# EAGLE design Blink_Schematic (EAGLE 9.1.0)
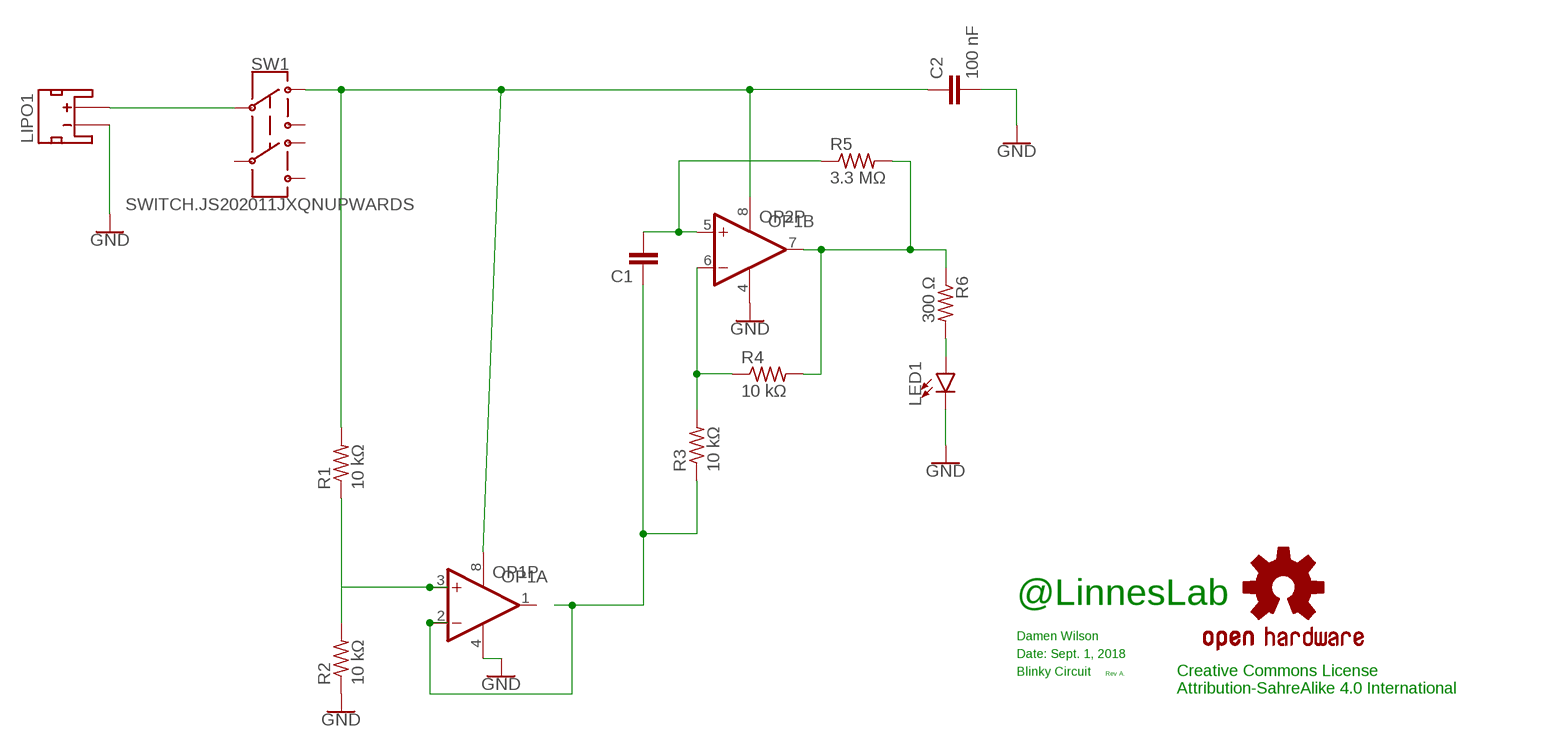
[diagram p0: schematic, sheet 1]

## Parts
C1  C-EUC0402  [C0402]
C2  100 nF  C-EUC0402  [C0402]
LED1  LED0603  [LED-0603]
LIPO1  JST_2MM_MALE  [JST-2-SMD]
LOGO1  OSHW-LOGOS-COPPER  [OSHW-LOGO-S_COPPER]
OP1  OP-DUALRM  [MSOP08]
OP2  OP-DUALRM  [MSOP08]
R1  10 kΩ  R-US_R0402  [R0402]
R2  10 kΩ  R-US_R0402  [R0402]
R3  10 kΩ  R-US_R0402  [R0402]
R4  10 kΩ  R-US_R0402  [R0402]
R5  3.3 MΩ  R-US_R0402  [R0402]
R6  300 Ω  R-US_R0402  [R0402]
SW1  SWITCH.JS202011JXQNUPWARDS  [SWITCH.00]

## Nets
GND: C2.2 LED1.C LIPO1.1(-) OP1.4(P:V-) OP2.4(P:V-) R2.1
N$1: LED1.A R6.2
N$2: OP1.7(B:OUT) R4.2 R5.2 R6.1
N$3: C2.1 OP1.8(P:V+) OP2.8(P:V+) R1.2 SW1.1
N$4: C1.2 OP1.5(B:+IN) R5.1
N$5: C1.1 OP1.2(A:-IN) R3.1
N$6: OP1.6(B:-IN) R3.2 R4.1
N$7: R1.1 R2.2
N$8: OP1.3(A:+IN)
N$9: LIPO1.2(+) SW1.2
Unconnected: LIPO1.NC1(PAD1) LIPO1.NC2(PAD2) OP1.1(A:OUT) OP2.1(A:OUT) OP2.2(A:-IN) OP2.3(A:+IN) OP2.5(B:+IN) OP2.6(B:-IN) OP2.7(B:OUT) SW1.3 SW1.5 SW1.6 SW1.7

## Notes on the sheet
- @LinnesLab
- Damen Wilson
- Date: Sept. 1, 2018
- Blinky Circuit | Rev A.
- Creative Commons License
  Attribution-SahreAlike 4.0 International

## Library data of the parts
C1 C2 = resistor:C-EU: CAPACITOR, European symbol
LED1 = CalvEngIO-LED:LED: LED (Generic) Standard schematic elements and footprints for 5mm, 3mm, 1206, and 0603 sized LEDs. Generic LEDs with no color specified. LTST-C190KGKT: arrow indicates cathode
LIPO1 = CalvEngIO-Connectors:JST_2MM_MALE: JST 2MM MALE RA CONNECTOR Two pin, compact surface mount connector. Commonly used as a battery input connection point. We really like the solid locking feeling and high current rating on these small connectors. We use these all the time as battery connectors. Mates to single-cell LiPo batteries. Here is the connector we sell at SparkFun: JST Right Angle Connector - White <https://www.sparkfun.com/products/8612> (PRT-08612) Datasheet <http://www.sparkfun.com/datasheets/Prototyping/Connectors/JST-Horizontal.pdf> It was used on these SparkFun products: SparkFun MOSFET Power Controller <https://www.sparkfun.com/products/11214> (PRT-11214) SparkFun Battery Babysitter - LiPo Battery Manager <https://www.sparkfun.com/products/13777> (PRT-13777) And many, many others that required a lipo battery connection.; PROD_ID: CONN-11443; SF_ID: PRT-08612
LOGO1 = CalvEngIO-Logos:OSHW-LOGO: Open-Source Hardware (OSHW) Logo This logo indicates the piece of hardware it is found on incorporates a OSHW license and/or adheres to the definition of open source hardware found here: http://freedomdefined.org/OSHW
OP1 OP2 = CalvEngIO-AnalogIC:OP-DUAL: Precision Micropower, Low Noise CMOS, Rail-to-Rail Input/Output Operational Amplifiers Source: http://www.analog.com/static/imported-files/data_sheets/AD8603_8607_8609.pdf; MF: ALTERA CORPORATION; MPN: AD8607ARMZ-REEL; OC_FARNELL: 1464990; OC_NEWARK: 59K6925
R1-R6 = rcl:R-US_: RESISTOR, American symbol; SPICEPREFIX: R
SW1 = CalvEngIO-Switches:SWITCH.JS202011JXQN: Manufacturer's Part Numer: JS202011JAQN for right angle throw JS202011JCQN for top side throw

## Net classes
0 default: width 0.305 mm, drill 0.508 mm, clearance 0.254 mm

## Board
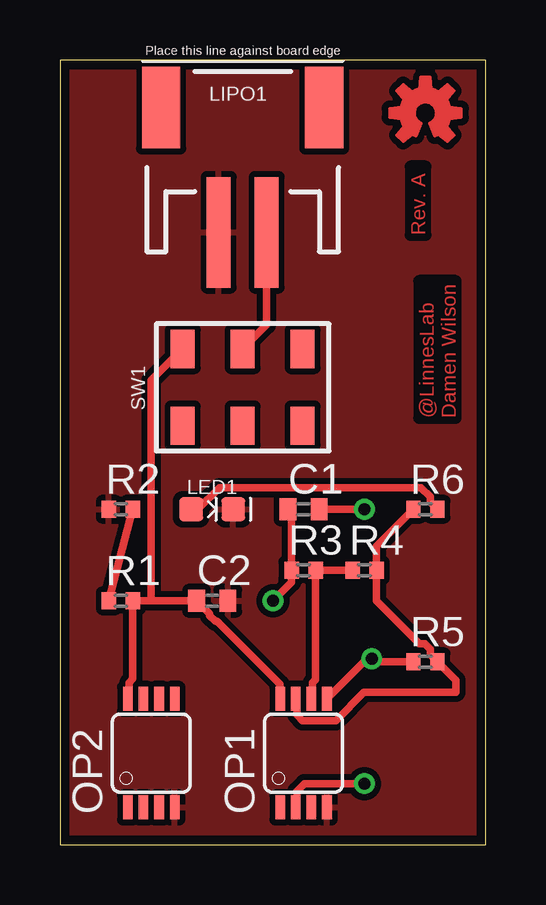
[diagram p1: board, top side]
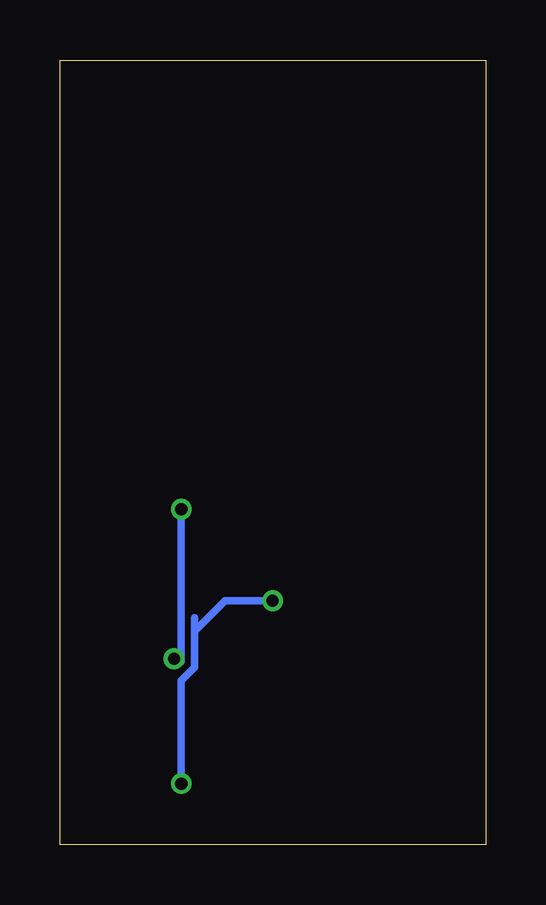
[diagram p2: board, bottom side, seen from below]

Size 17.76 x 32.69 mm. Coordinates in mm from the lower left corner, seen from the top.
Outline: 0,0 17.76,0 17.76,32.69 0,32.69 0,0
Copper layers (1*16): Top 0.0356mm / dielectric 1.5011mm / Bottom 0.0356mm
Design rules "LaenPCBOrder": minimum track width 6mil, minimum drill 13mil, track to track 6mil, track to pad 6mil, pad to pad 6mil, via to via 6mil, smd to smd 6mil, copper to edge 15mil, drill to drill 6mil, minimum pad ring 7mil, minimum via ring 7mil, stop-mask expansion 3mil, vias tented up to drill 0mil, thermal gap 10mil

### Footprints (pad centres in the part's own frame; a part is rotated, then mirrored left to right if it is on the bottom)
C0402 = smd 0.7 x 0.9: 1 -0.65,0; 2 0.65,0
LED-0603 = smd 1 x 1: A -0.877,0; C 0.877,0
JST-2-SMD = smd 1 x 4.6: 1 -1,-3.7; 2 1,-3.7 | smd 1.6 x 3.4: NC1 -3.4,1.5; NC2 3.4,1.5
MSOP08 = smd 0.4 x 1: 1 -0.976,-2.263; 2 -0.326,-2.263; 3 0.324,-2.263; 4 0.974,-2.263; 5 0.974,2.262; 6 0.324,2.262; 7 -0.326,2.262; 8 -0.976,2.262
R0402 = smd 0.6 x 0.7: 1 -0.5,0; 2 0.5,0
SWITCH.00 = smd 1 x 1.6: 1 -2.5,1.6; 2 0,1.6; 3 2.5,1.6; 5 -2.5,-1.6; 6 0,-1.6; 7 2.5,-1.6

### Placement (x,y rotation side)
C1  10.16,13.97 0 top
C2  6.35,10.16 0 top
LED1  6.35,13.97 0 top
LIPO1  7.62,29.21 0 top
LOGO1  15.24,30.48 0 top
OP1  10.16,3.81 0 top
OP2  3.81,3.81 0 top
R1  2.54,10.16 0 top
R2  2.54,13.97 0 top
R3  10.16,11.43 0 top
R4  12.7,11.43 0 top
R5  15.24,7.62 0 top
R6  15.24,13.97 0 top
SW1  7.62,19.05 0 top

### Tracks (layer width: path | path; a pad name or v marks a point on that pad's centre or on a via)
GND
  pour Top: -1.27,33.02 -1.27,-1.27 19.05,-1.27 19.05,34.29 -1.27,34.29
N$1
  Top 0.305: LED1.A 5.74,13.97 6.65,14.88 15.06,14.88 15.45,14.49 15.45,14.26 R6.2
N$2
  Top 0.305: R6.1 13.2,12.43 R4.2 13.2,10.16 14.98,8.38 15.21,8.38 15.45,8.14 15.45,7.91 R5.2 16.51,6.85 16.51,6.35 12.69,6.35 11.5,5.17 10.12,5.17 9.88,5.4 9.88,6.03 OP1.7
N$3
  Top 0.305: 3.81,10.16 C2.1 6.24,9.62 6.24,9.54 6.48,9.3 6.56,9.3 9.18,6.68 OP1.8 | 3.81,10.16 R1.2 3.04,6.9 2.88,6.74 2.88,6.12 OP2.8 | SW1.1 3.81,19.34 3.81,10.16
N$4  (via drill 0.51)
  Top 0.305: OP1.5 12.68,7.62 12.7,7.62 | 12.7,7.62 R5.1 | C1.2 v12.7,13.97 | v13.01,7.75 12.83,7.75 12.7,7.62
  Bottom 0.305: v12.7,13.97 12.7,7.62 12.83,7.75 v13.01,7.75
N$5  (via drill 0.51)
  Top 0.305: C1.1 9.66,13.82 R3.1 9.66,10.93 v8.89,10.16 | OP1.2 9.88,1.59 9.88,2.21 10.2,2.54 v12.7,2.54
  Bottom 0.305: 12.14,8.89 12.14,7.39 12.7,6.83 v12.7,2.54 | 12.14,8.89 12.14,9.45 | 12.14,8.89 10.87,10.16 v8.89,10.16
N$6
  Top 0.305: OP1.6 10.53,6.12 10.53,6.74 10.66,6.87 R3.2 R4.1
N$7
  Top 0.305: R2.2 R1.1
N$9
  Top 0.305: LIPO1.2 8.62,21.65 SW1.2

### Text on the board
Top: Rev. A | @LinnesLab / Damen Wilson